# EAGLE design Phoenix_TX (EAGLE 4.16)
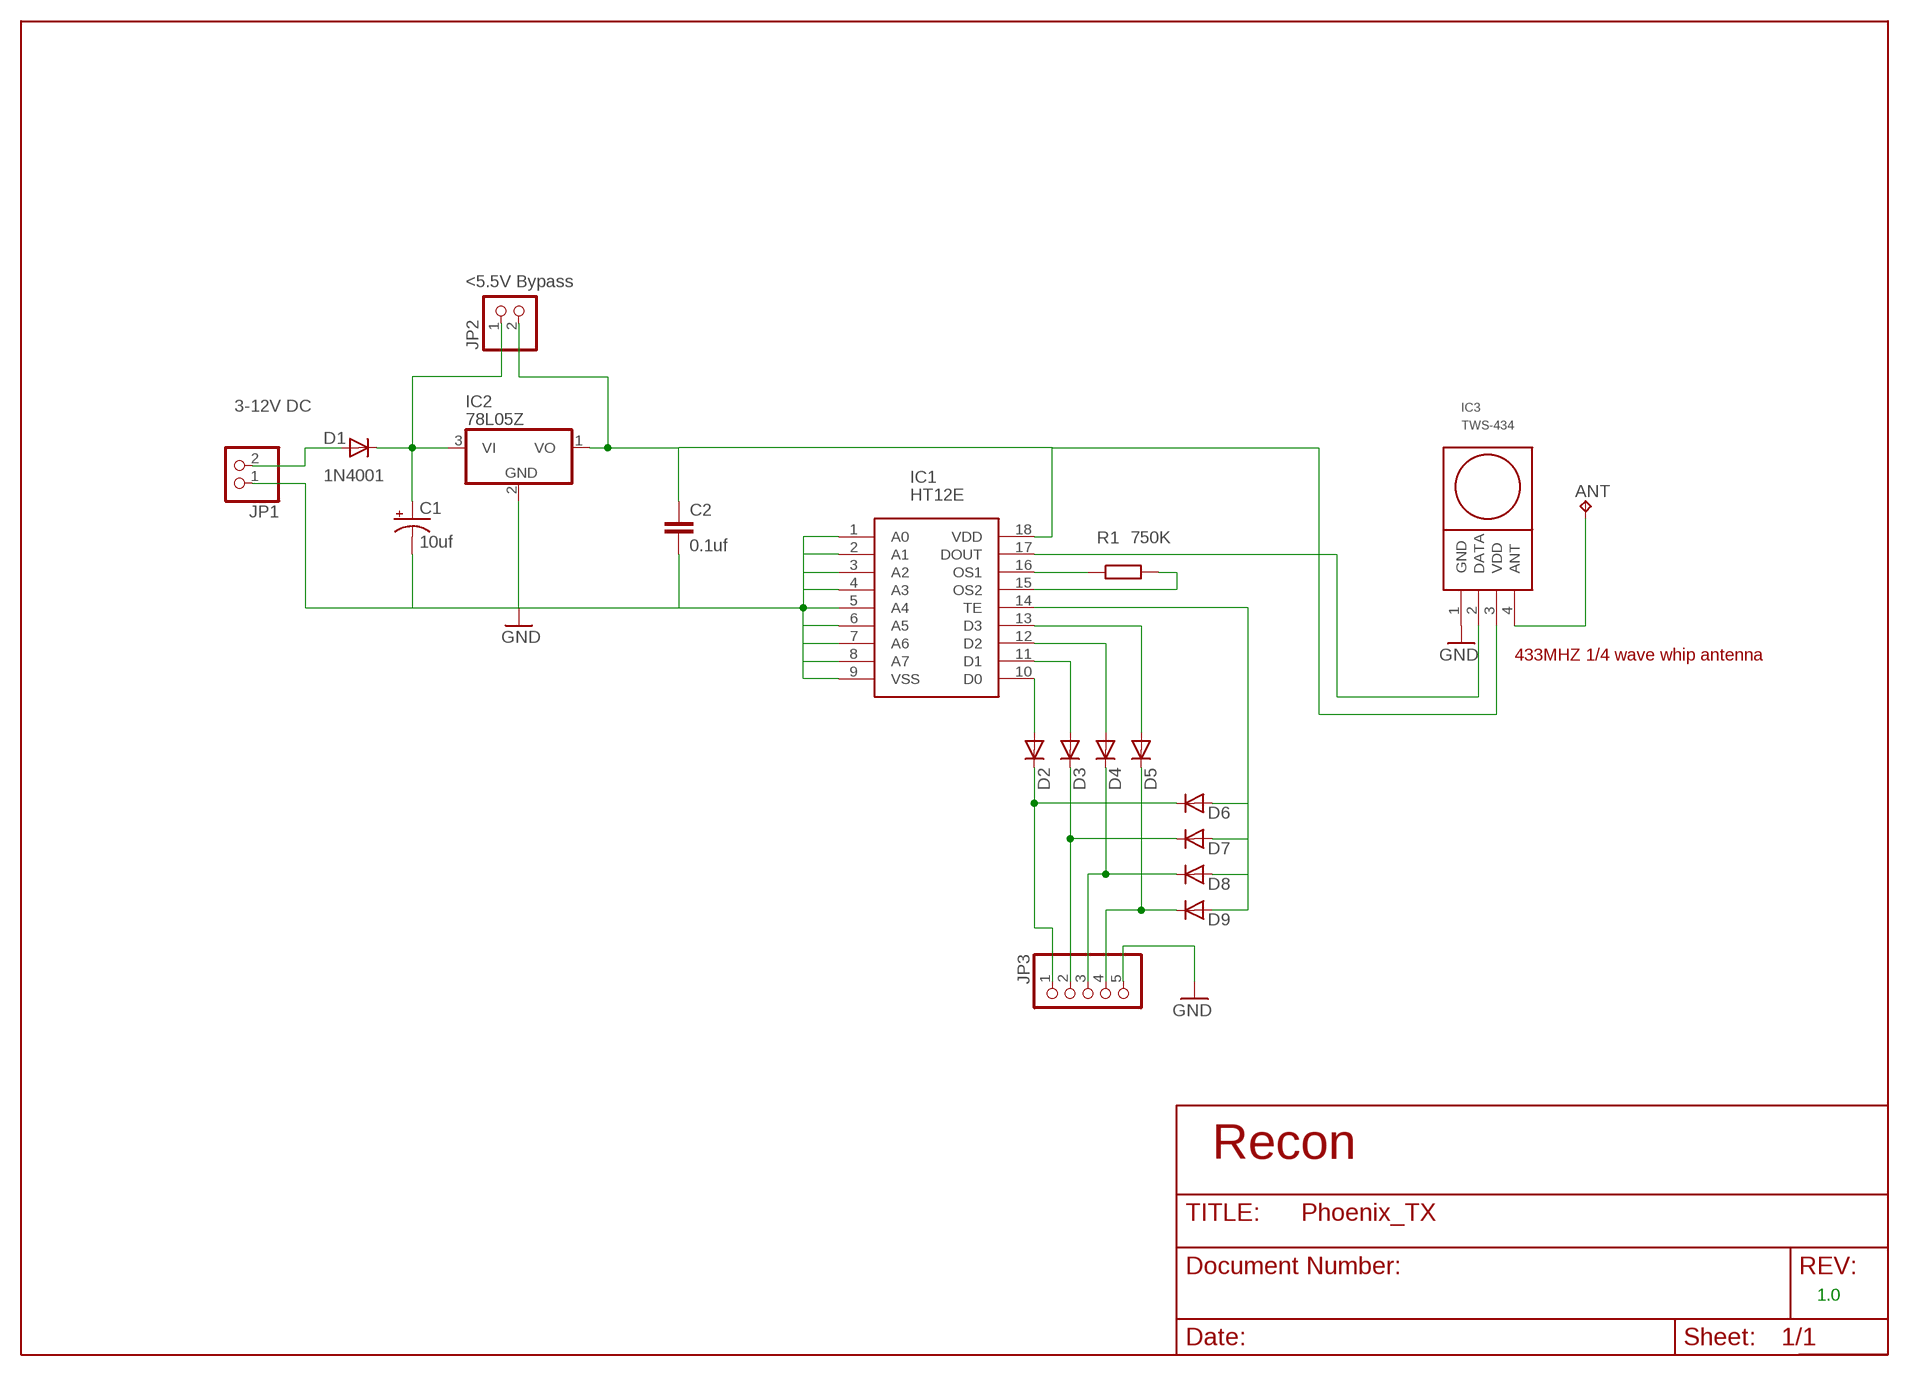
[diagram p0: schematic, sheet 1]

## Parts
ANT  433 qtr wave whip  TPPAD1-13Y  [P1-13Y]
C1  10uf  CPOL-USE2.5-5  [E2,5-5]
C2  0.1uf  C-EU025-030X050  [C025-030X050]
D1  1N4001  [DO41-10]
D2  1N4148  [DO35-10]
D3  1N4148  [DO35-10]
D4  1N4148  [DO35-10]
D5  1N4148  [DO35-10]
D6  1N4148  [DO35-10]
D7  1N4148  [DO35-10]
D8  1N4148  [DO35-10]
D9  1N4148  [DO35-10]
IC1  HT12E  [DIL18]
IC2  78L05Z  [TO92]
IC3  TWS-434  [TWS-434]
JP1  PINHD-1X2  [1X02]
JP2  PINHD-1X2  [1X02]
JP3  PINHD-1X5  [1X05]
R1  750K  R-EU_0207/7  [0207/7]

## Nets
D_OUT: IC1.17(DOUT) IC3.2(DATA)
GND: C1.- C2.2 IC1.1(A0) IC1.2(A1) IC1.3(A2) IC1.4(A3) IC1.5(A4) IC1.6(A5) IC1.7(A6) IC1.8(A7) IC1.9(VSS) IC2.2(GND) IC3.1(GND) JP1.1 JP3.5
N$1: D1.A JP1.2
N$2: C1.+ D1.C IC2.3(VI) JP2.1
N$3: IC1.16(OS1) R1.1
N$4: IC1.15(OS2) R1.2
N$5: D2.A IC1.10(D0)
N$6: ANT.1(TP) IC3.4(ANT)
N$7: D3.A IC1.11(D1)
N$8: D4.A IC1.12(D2)
N$9: D5.A IC1.13(D3)
N$10: D2.C D6.C JP3.1
N$11: D3.C D7.C JP3.2
N$12: D4.C D8.C JP3.3
N$13: D5.C D9.C JP3.4
N$14: C2.1 IC1.18(VDD) IC2.1(VO) IC3.3(VDD) JP2.2
TE: D6.A D7.A D8.A D9.A IC1.14(TE)

## Notes on the sheet
- <5.5V Bypass
- 3-12V DC
- 433MHZ 1/4 wave whip antenna
- 1.0

## Library data of the parts
ANT = Stofer:TP
C1 = rcl:CPOL-US: POLARIZED CAPACITOR, American symbol
C2 = Recon:C-EU: CAPACITOR, European symbol
D1 = Recon:1N4001: DIODE general purpose rectifier, 1 A
D2-D9 = Recon:1N4148: DIODE high speed (Philips)
IC1 = Recon:HT12E
IC2 = Recon:78*: Positive VOLTAGE REGULATOR Source: http://cache.national.com/ds/LM/LM78L05.pdf http://www.fairchildsemi.com/ds/LM/LM7805.pdf
IC3 = Recon:TWS-434
JP1 JP2 = Recon:PINHD-1X2: PIN HEADER
JP3 = Recon:PINHD-1X5: PIN HEADER
R1 = Recon:R-EU_: RESISTOR, European symbol

## Board
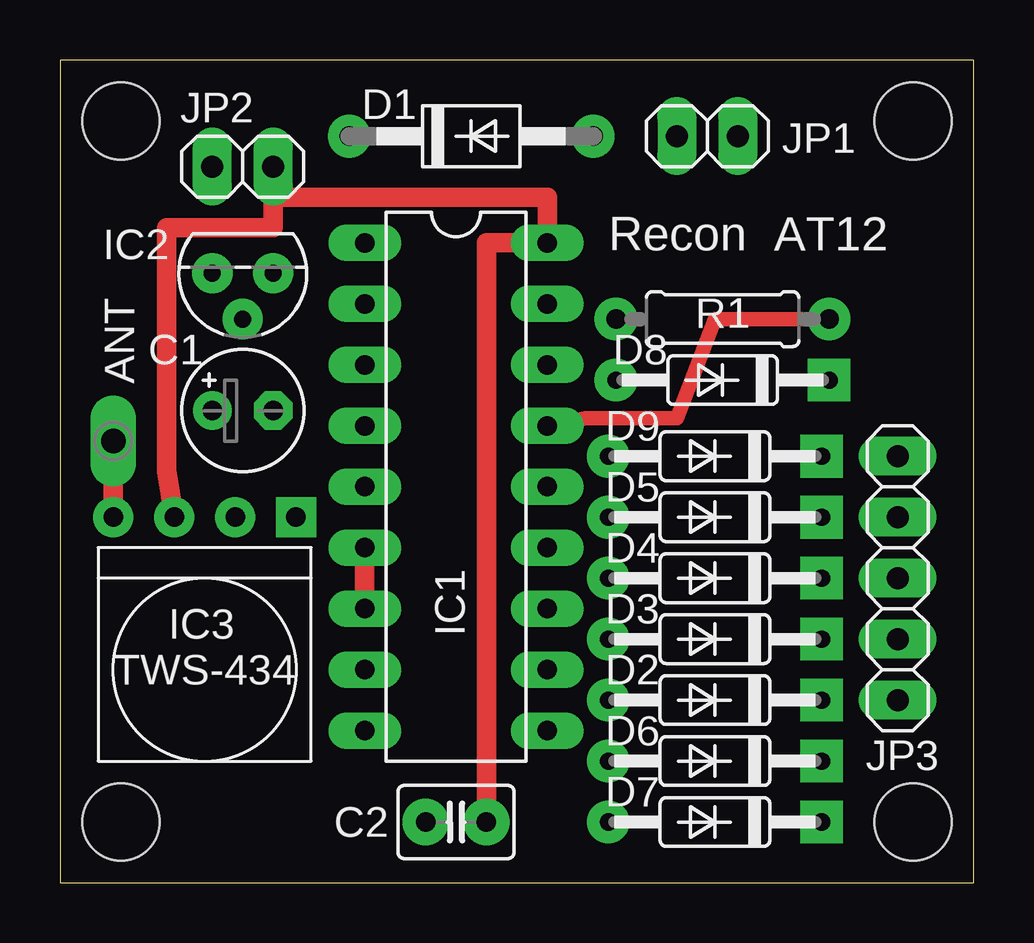
[diagram p1: board, top side]
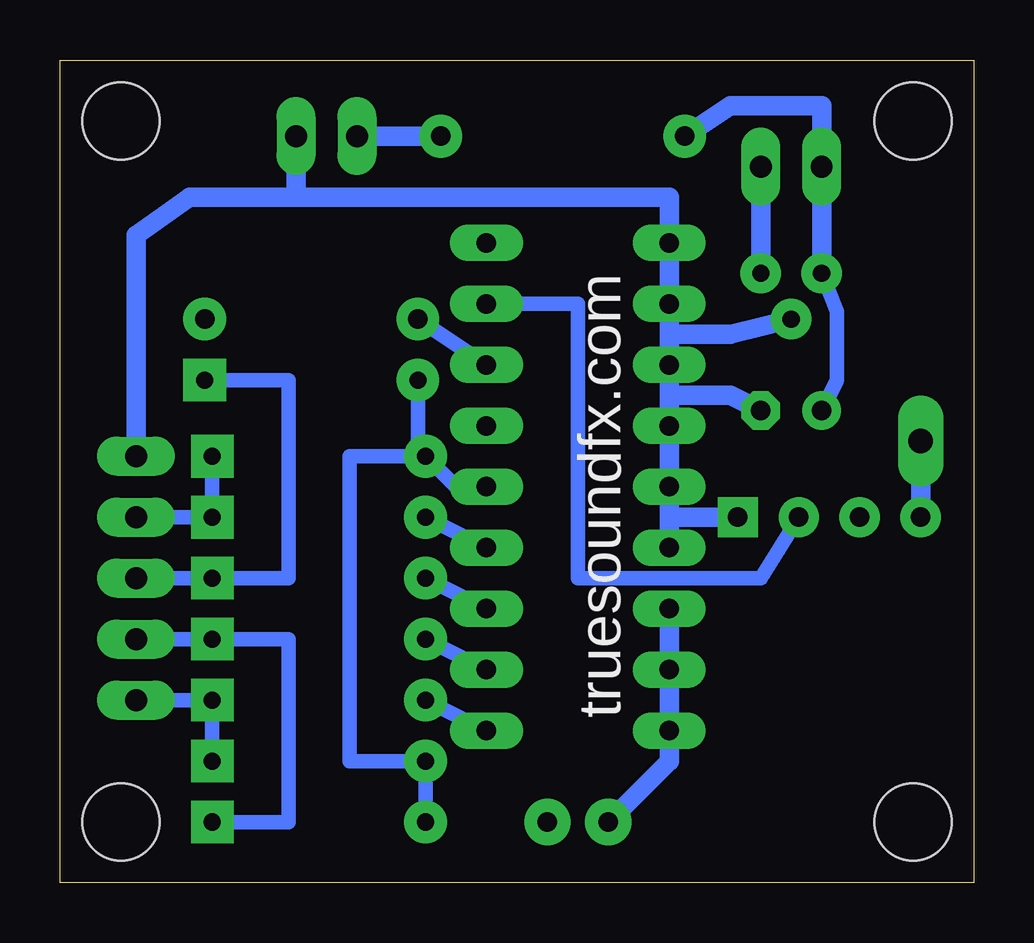
[diagram p2: board, bottom side, seen from below]

Size 38.1 x 34.29 mm. Coordinates in mm from the lower left corner, seen from the top.
Outline: 0,0 38.1,0 38.1,34.29 0,34.29 0,0
Copper layers (1*2+15*16): Top 0.035mm / dielectric 0.2mm / Route2 0.035mm / dielectric 0.15mm / Route15 0.035mm / dielectric 0.2mm / Bottom 0.035mm
Design rules "default": minimum track width 10mil, minimum drill 24mil, track to track 8mil, track to pad 8mil, pad to pad 8mil, via to via 8mil, smd to smd 8mil, copper to edge 40mil, drill to drill 8mil, minimum pad ring 14mil, minimum via ring 8mil, stop-mask expansion 4mil, vias tented up to drill 0mil, thermal gap 10mil
Holes 3.2 mm at 2.54,31.75 35.56,2.54 2.54,2.54 35.56,31.75

### Footprints (pad centres in the part's own frame; a part is rotated, then mirrored left to right if it is on the bottom)
P1-13Y = drill 1.016 pad 1.905 long: 1 0,0
E2,5-5 = drill 0.813 pad 1.6 round: + -1.27,0 | drill 0.813 pad 1.6 octagon: - 1.27,0
C025-030X050 = drill 0.813 pad 1.93 round: 1 -1.27,0; 2 1.27,0
DO41-10 = drill 0.813 pad 1.778 round: A 5.08,0; C -5.08,0
DO35-10 = drill 0.711 pad 1.778 round: A 4.445,0 | drill 0.711 pad 1.778 square: C -4.445,0
DIL18 = drill 0.813 long: 1 -10.16,-3.81; 2 -7.62,-3.81; 3 -5.08,-3.81; 4 -2.54,-3.81; 5 0,-3.81; 6 2.54,-3.81; 7 5.08,-3.81; 8 7.62,-3.81; 9 10.16,-3.81; 10 10.16,3.81; 11 7.62,3.81; 12 5.08,3.81; 13 2.54,3.81; 14 0,3.81; 15 -2.54,3.81; 16 -5.08,3.81; 17 -7.62,3.81; 18 -10.16,3.81
TO92 = drill 0.711 pad 1.676 round: 1 -1.27,0; 2 0,1.905; 3 1.27,0
TWS-434 = drill 0.813 pad 1.676 square: 1 -5.08,-2.54 | drill 0.813 pad 1.676 round: 2 -2.54,-2.54; 3 0,-2.54; 4 2.54,-2.54
1X02 = drill 0.914 long: 1 -1.27,0; 2 1.27,0
1X05 = drill 0.914 long: 1 -5.08,0; 2 -2.54,0; 3 0,0; 4 2.54,0; 5 5.08,0
0207/7 = drill 0.813 pad 1.778 round: 1 -4.445,0; 2 4.445,0

### Placement (x,y rotation side)
ANT  2.22,18.41 180 top
C1  7.62,19.68 0 top
C2  16.51,2.54 180 top
D1  17.14,31.11 0 top
D2  27.3,7.62 180 top
D3  27.3,10.16 180 top
D4  27.3,12.7 180 top
D5  27.3,15.24 180 top
D6  27.3,5.08 180 top
D7  27.3,2.54 180 top
D8  27.62,20.95 180 top
D9  27.3,17.78 180 top
IC1  16.51,16.51 270 top
IC2  7.62,25.4 180 top
IC3  4.76,12.7 180 top
JP1  26.99,31.11 180 top
JP2  7.62,29.84 0 top
JP3  34.92,12.7 90 top
R1  27.62,23.5 0 top

### Tracks (layer width: path | path; a pad name or v marks a point on that pad's centre or on a via)
D_OUT
  Bottom 0.61: IC1.17 16.51,24.13 16.51,12.7 8.89,12.7 IC3.2
GND
  Top 0.813: IC1.7 IC1.6
  Bottom 0.813: IC1.7 IC1.8 IC1.9 12.7,5.08 C2.2 | 12.7,22.86 IC1.2 IC1.1 12.7,28.57 28.26,28.57 | IC3.1 12.7,15.24 IC1.6 IC1.5 IC1.4 12.7,20.32 | 12.7,22.86 IC1.3 12.7,20.32 | 28.26,28.57 32.7,28.57 34.92,26.99 JP3.5 | 28.26,28.57 JP1.1 | IC2.2 10.16,22.86 12.7,22.86 | C1.- 10.16,20.32 12.7,20.32
N$1
  Bottom 0.813: D1.A JP1.2
N$2
  Bottom 0.61: IC2.3 5.71,23.81 5.71,20.95 C1.+
  Bottom 0.813: IC2.3 JP2.1 6.35,32.38 10.16,32.38 D1.C
N$3
  Bottom 0.61: IC1.16 R1.1
N$4
  Top 0.61: IC1.15 21.91,19.37 25.72,19.37 27.3,23.5 R1.2
N$5
  Bottom 0.61: IC1.10 D2.A
N$6
  Top 0.813: IC3.4 ANT.1
  Bottom 0.813: IC3.4 ANT.1
N$7
  Bottom 0.61: IC1.11 D3.A
N$8
  Bottom 0.61: IC1.12 D4.A
N$9
  Bottom 0.61: IC1.13 D5.A
N$10
  Bottom 0.61: D6.C D2.C JP3.1
N$11
  Bottom 0.61: D7.C 28.57,2.54 28.57,10.16 D3.C JP3.2
N$12
  Bottom 0.61: D8.C 28.57,20.95 28.57,12.7 D4.C JP3.3
N$13
  Bottom 0.61: D9.C D5.C JP3.4
N$14
  Top 0.813: 8.89,28.57 20.32,28.57 IC1.18 17.78,26.67 C2.1 | JP2.2 8.89,28.57 | 8.89,28.57 8.89,27.3 4.45,27.3 4.45,17.14 IC3.3
  Bottom 0.813: JP2.2 IC2.1
TE
  Bottom 0.61: D6.A D7.A D6.A | D6.A 26.04,5.08 26.04,17.78 D9.A | D9.A 23.18,17.78 D8.A | IC1.14 21.59,16.51 D9.A

### Text on the board
bPlace: truesoundfx.com
tNames: Recon AT12
Drill_legend: Drill legend | Date: 1/19/2013 03:52:48p | 3.2000 mm / 125.984 mil | 1.0160 mm / 40.000 mil | 0.9144 mm / 36.000 mil | 0.8128 mm / 32.000 mil | 0.7112 mm / 28.000 mil